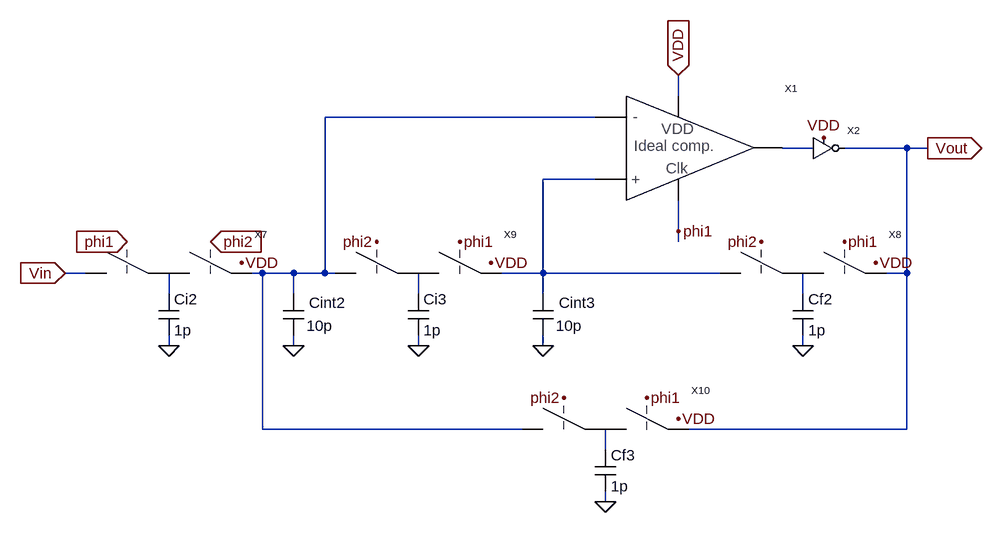
[diagram p0: schematic 1_bit_2nd_PNS_SCmod_MSD.asc]
1_bit_2nd_PNS_SCmod_MSD.asc, the LTspice schematic file:
Version 4
SHEET 1 2820 680
WIRE 2320 -784 2320 -816
WIRE 2192 -752 1776 -752
WIRE 2528 -704 2480 -704
WIRE 2672 -704 2576 -704
WIRE 2704 -704 2672 -704
WIRE 2192 -656 2112 -656
WIRE 2320 -576 2320 -624
WIRE 2320 -560 2320 -576
WIRE 1408 -512 1376 -512
WIRE 1680 -512 1664 -512
WIRE 1728 -512 1680 -512
WIRE 1776 -512 1776 -752
WIRE 1776 -512 1728 -512
WIRE 1792 -512 1776 -512
WIRE 2112 -512 2112 -656
WIRE 2112 -512 2048 -512
WIRE 2384 -512 2112 -512
WIRE 2672 -512 2672 -704
WIRE 2672 -512 2640 -512
WIRE 1536 -480 1536 -512
WIRE 1728 -480 1728 -512
WIRE 1920 -480 1920 -512
WIRE 2112 -480 2112 -512
WIRE 2512 -480 2512 -512
WIRE 1536 -400 1536 -416
WIRE 1728 -400 1728 -416
WIRE 1920 -400 1920 -416
WIRE 2112 -400 2112 -416
WIRE 2512 -400 2512 -416
WIRE 1680 -272 1680 -512
WIRE 2080 -272 1680 -272
WIRE 2672 -272 2672 -512
WIRE 2672 -272 2336 -272
WIRE 2208 -240 2208 -272
WIRE 2208 -160 2208 -176
FLAG 2704 -704 Vout
IOPIN 2704 -704 Out
FLAG 2320 -816 VDD
IOPIN 2320 -816 In
FLAG 1376 -512 Vin
IOPIN 1376 -512 In
FLAG 1472 -560 phi1
IOPIN 1472 -560 In
FLAG 1600 -560 phi2
IOPIN 1600 -560 In
FLAG 1728 -400 0
FLAG 2544 -720 VDD
FLAG 2512 -400 0
FLAG 1536 -400 0
FLAG 2624 -528 VDD
FLAG 1648 -528 VDD
FLAG 2576 -560 phi1
FLAG 2448 -560 phi2
FLAG 2320 -576 phi1
FLAG 2112 -400 0
FLAG 1920 -400 0
FLAG 2032 -528 VDD
FLAG 1856 -560 phi2
FLAG 1984 -560 phi1
FLAG 2208 -160 0
FLAG 2320 -288 VDD
FLAG 2272 -320 phi1
FLAG 2144 -320 phi2
SYMBOL Ideal_clocked_comparator 2240 -704 R0
SYMATTR InstName X1
SYMBOL cap 1712 -480 R0
WINDOW 0 40 14 Left 0
WINDOW 3 36 49 Left 0
SYMATTR InstName Cint2
SYMATTR Value 10p
SYMBOL inverter 2528 -704 R0
SYMATTR InstName X2
SYMBOL switches_2 1408 -496 R0
SYMATTR InstName X7
SYMBOL switches_2 2384 -496 R0
SYMATTR InstName X8
SYMBOL cap 1520 -480 R0
SYMATTR InstName Ci2
SYMATTR Value 1p
SYMBOL cap 2496 -480 R0
SYMATTR InstName Cf2
SYMATTR Value 1p
SYMBOL cap 2096 -480 R0
WINDOW 0 40 14 Left 0
WINDOW 3 36 49 Left 0
SYMATTR InstName Cint3
SYMATTR Value 10p
SYMBOL switches_2 1792 -496 R0
SYMATTR InstName X9
SYMBOL cap 1904 -480 R0
SYMATTR InstName Ci3
SYMATTR Value 1p
SYMBOL switches_2 2080 -256 R0
SYMATTR InstName X10
SYMBOL cap 2192 -240 R0
SYMATTR InstName Cf3
SYMATTR Value 1p

The netlist it stands for:
* 1_bit_2nd_PNS_SCmod_MSD.asc
XX1 N001 N003 N002 VDD phi1 Ideal_clocked_comparator  ; pins Vinm Vinp Vout VDD Clock
Cint2 N001 0 10p
XX2 N002 Vout VDD inverter  ; pins In Out VDD
XX7 Vin phi1 phi2 N001 VDD N004 switches_2  ; pins P1 clk1 Clk2 P3 VDD P2
XX8 N003 phi2 phi1 Vout VDD N006 switches_2  ; pins P1 clk1 Clk2 P3 VDD P2
Ci2 N004 0 1p
Cf2 N006 0 1p
Cint3 N003 0 10p
XX9 N001 phi2 phi1 N003 VDD N005 switches_2  ; pins P1 clk1 Clk2 P3 VDD P2
Ci3 N005 0 1p
XX10 N001 phi2 phi1 Vout VDD N007 switches_2  ; pins P1 clk1 Clk2 P3 VDD P2
Cf3 N007 0 1p
.backanno
.end